# EAGLE schematic fulldrive2 (EAGLE 9.6.0)
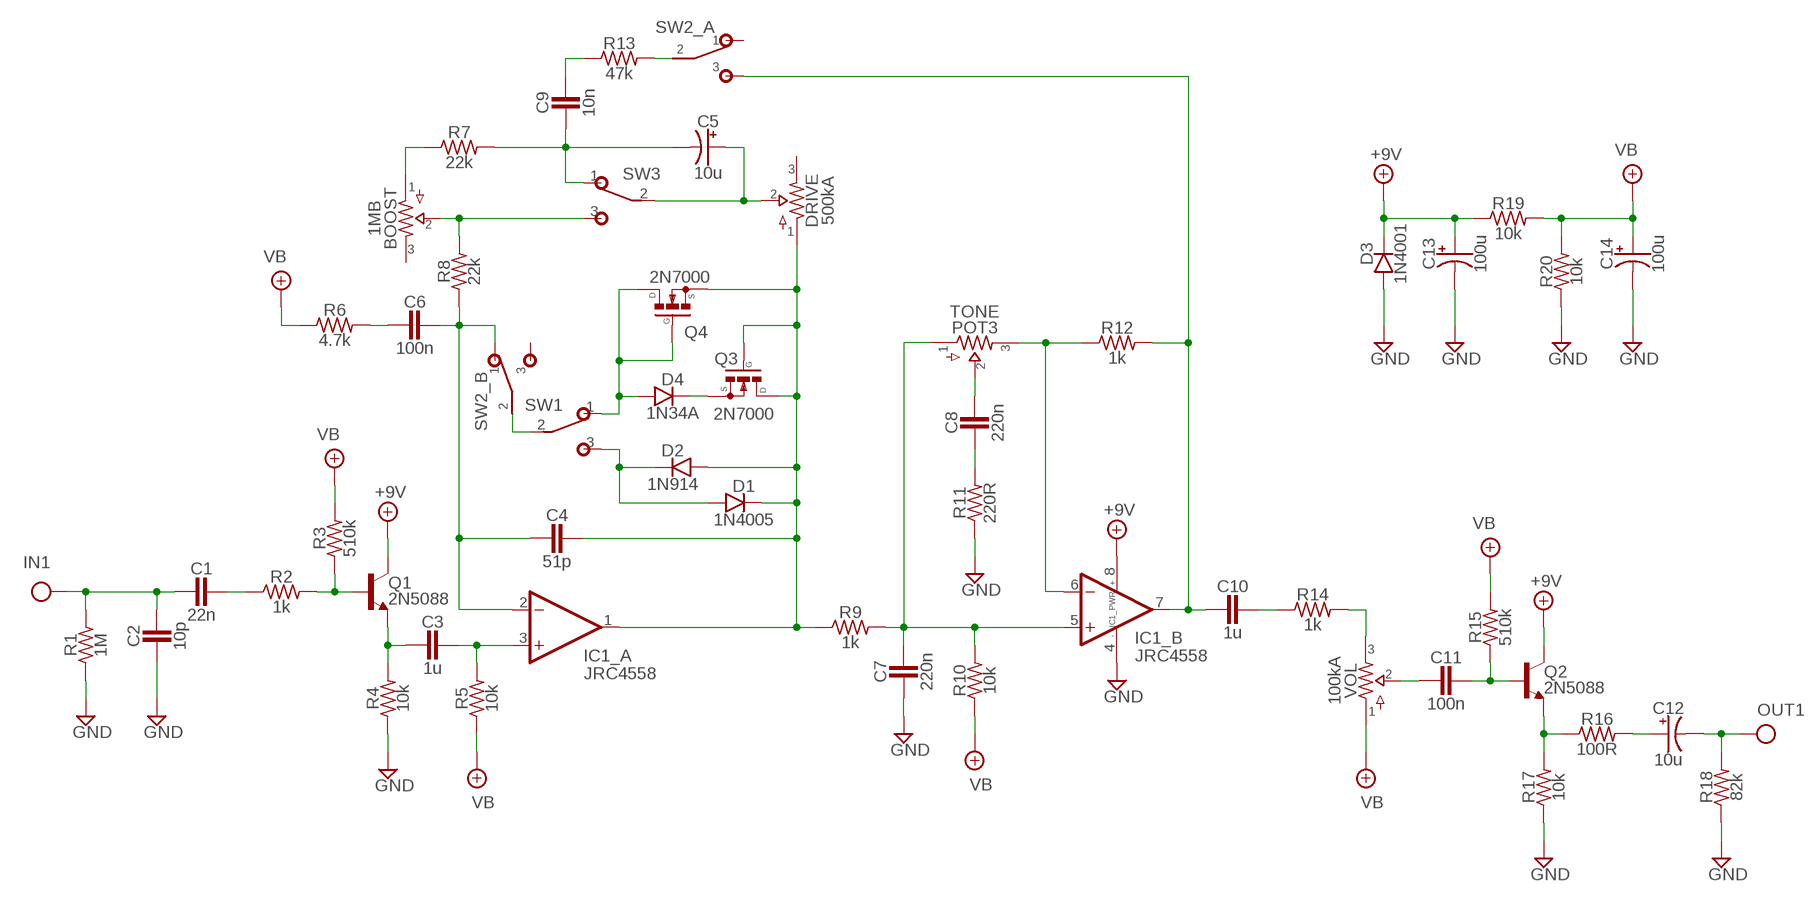
[diagram p0: schematic, sheet 1]

## Parts
BOOST  1MB  POTS16MM  [16MM]
C1  22n  CER/FILMBOX.1  [BOX_SMALL]
C2  10p  CER/FILMBOX.1  [BOX_SMALL]
C3  1u  CER/FILMBOX.1  [BOX_SMALL]
C4  51p  CER/FILMBOX.1  [BOX_SMALL]
C5  10u  0500  [050_020]
C6  100n  CER/FILMBOX.1  [BOX_SMALL]
C7  220n  CER/FILMBOX.1  [BOX_SMALL]
C8  220n  CER/FILMBOX.1  [BOX_SMALL]
C9  10n  CER/FILMBOX.1  [BOX_SMALL]
C10  1u  CER/FILMBOX.1  [BOX_SMALL]
C11  100n  CER/FILMBOX.1  [BOX_SMALL]
C12  10u  0500  [050_020]
C13  100u  0500  [050_020]
C14  100u  0500  [050_020]
D1  1N4005  DO35.2  [DO35-2]
D2  1N914  DO35.2  [DO35-2]
D3  1N4001  DO35.3  [DO35-3]
D4  1N34A  DO35.2  [DO35-2]
DRIVE  500kA  POTS16MM  [16MM]
IC1  JRC4558  DUALTH  [DIL0]
POT3  TONE  POTS16MM  [16MM]
Q1  2N5088  [TO92-]
Q2  2N5088  [TO92-]
Q3  2N7000  [TO92-]
Q4  2N7000  [TO92-]
R1  1M  R_.3B  [R0207/3]
R2  1k  R_.3B  [R0207/3]
R3  510k  R_.3B  [R0207/3]
R4  10k  R_.3B  [R0207/3]
R5  10k  R_.3B  [R0207/3]
R6  4.7k  R_.3B  [R0207/3]
R7  22k  R_.3B  [R0207/3]
R8  22k  R_.3B  [R0207/3]
R9  1k  R_.3B  [R0207/3]
R10  10k  R_.3B  [R0207/3]
R11  220R  R_.3B  [R0207/3]
R12  1k  R_.3B  [R0207/3]
R13  47k  R_.3B  [R0207/3]
R14  1k  R_.3B  [R0207/3]
R15  510k  R_.3B  [R0207/3]
R16  100R  R_.3B  [R0207/3]
R17  10k  R_.3B  [R0207/3]
R18  82k  R_.3B  [R0207/3]
R19  10k  R_.3B  [R0207/3]
R20  10k  R_.3B  [R0207/3]
SW1  SPDT  [M9040P]
SW2  DPDT  [DPDT]
SW3  SPDT  [M9040P]
VOL  100kA  POTS16MM  [16MM]

## Nets
+9V: C13.+ D3.C IC1.8(_PWR:V+) Q1.1(C) Q2.1(C) R19.1
GND: C2.2 C7.2 C13.- C14.- D3.A IC1.4(_PWR:V-) R1.1 R4.1 R11.1 R17.1 R18.1 R20.1
IN: C1.2 C2.1 R1.2
N$2: C1.1 R2.1
N$3: Q1.2(B) R2.2 R3.1
N$4: C3.2 Q1.3(E) R4.2
N$5: C4.2 C6.1 IC1.2(_A:-IN) R8.1 SW2.B1
N$6: C4.1 D1.C D2.A DRIVE.1 IC1.1(_A:OUT) Q3.1(D) Q3.2(G) Q4.3(S) R9.1
N$7: D4.A Q4.1(D) Q4.2(G) SW1.1(O)
N$8: D4.C Q3.3(S)
N$9: D1.A D2.C SW1.3(S)
N$10: SW1.2(P) SW2.B2
N$11: C6.2 R6.2
N$12: BOOST.2 R8.2 SW3.3(S)
N$13: C5.+ DRIVE.2 SW3.2(P)
N$14: BOOST.1 R7.1
N$15: C5.- C9.2 R7.2 SW3.1(O)
N$16: C3.1 IC1.3(_A:+IN) R5.2
N$18: C7.1 IC1.5(_B:+IN) POT3.1 R9.2 R10.2
N$19: C9.1 R13.1
N$20: IC1.6(_B:-IN) POT3.3 R12.1
N$21: C10.2 IC1.7(_B:OUT) R12.2 SW2.A3
N$22: C8.1 POT3.2
N$23: C8.2 R11.2
N$24: R13.2 SW2.A2
N$25: C10.1 R14.1
N$26: R14.2 VOL.3
N$27: C11.2 VOL.2
N$28: C11.1 Q2.2(B) R15.1
N$29: Q2.3(E) R16.1 R17.2
N$30: C12.+ R16.2
OUT: C12.- R18.2
VB: C14.+ R3.2 R5.1 R6.1 R10.1 R15.2 R19.2 R20.2 VOL.1
Unconnected: BOOST.3 DRIVE.3 SW2.A1 SW2.B3

## Library data of the parts
BOOST DRIVE POT3 VOL = pedals-potentiometers:POTS
C1-C4 C6-C11 = pedals-capacitors-film:CER/FILM: 47 - 120pF Xicon Ceramic Disc 2.5mm lead spacing
C5 C12-C14 = pedals-capacitors-elec:050
D1-D4 = pedals-diodes:DO35: DO-35 Package Diodes: 1N914
IC1 = pedals-integrated circuits:DUAL: OP AMP
Q1 Q2 = pedals-transistors:2N5088: NPN Transistor
Q3 Q4 = pedals-transistors:2N7000
R1-R20 = pedals-resistors:R_
SW1 SW3 = pedals-switches:SPDT: TOGGLE SWITCH Marquardt
SW2 = pedals-switches:DPDT